# Altium schematic sheet Sheet_2_2021-06-04.schdoc
size 628 x 245 mm
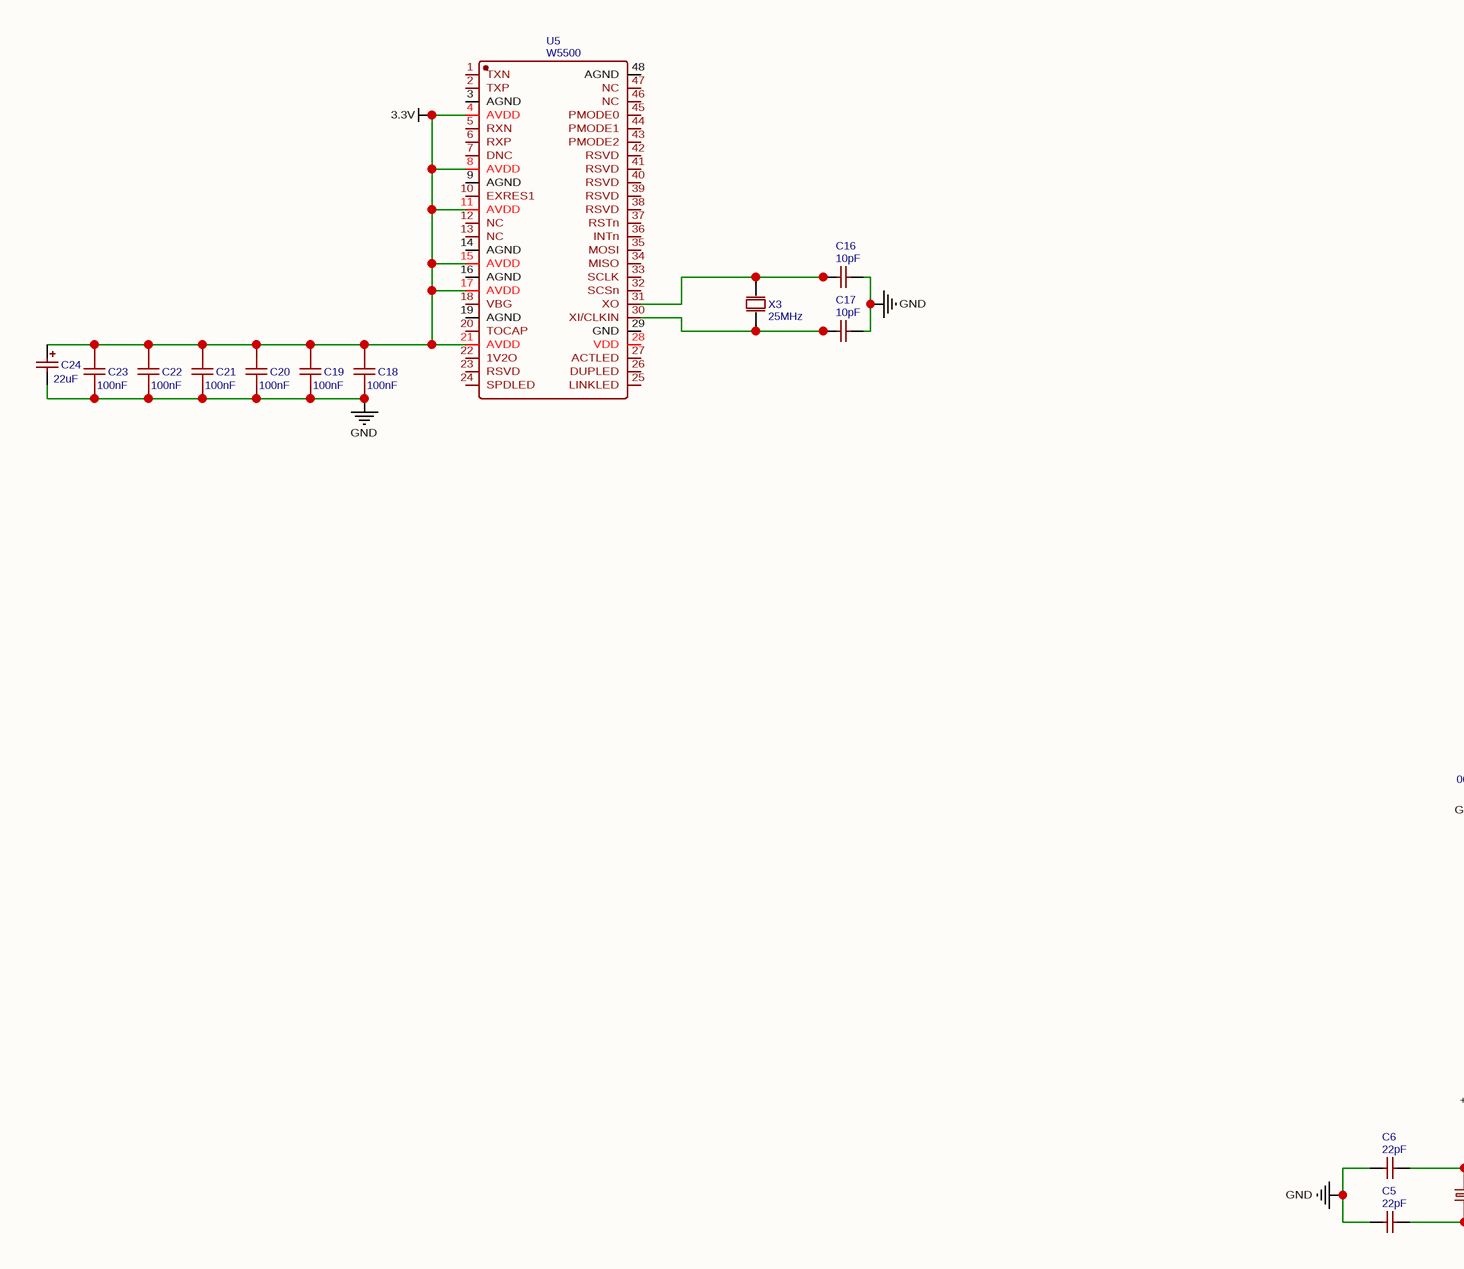
[diagram p0: Sheet_2_2021-06-04.schdoc, left]
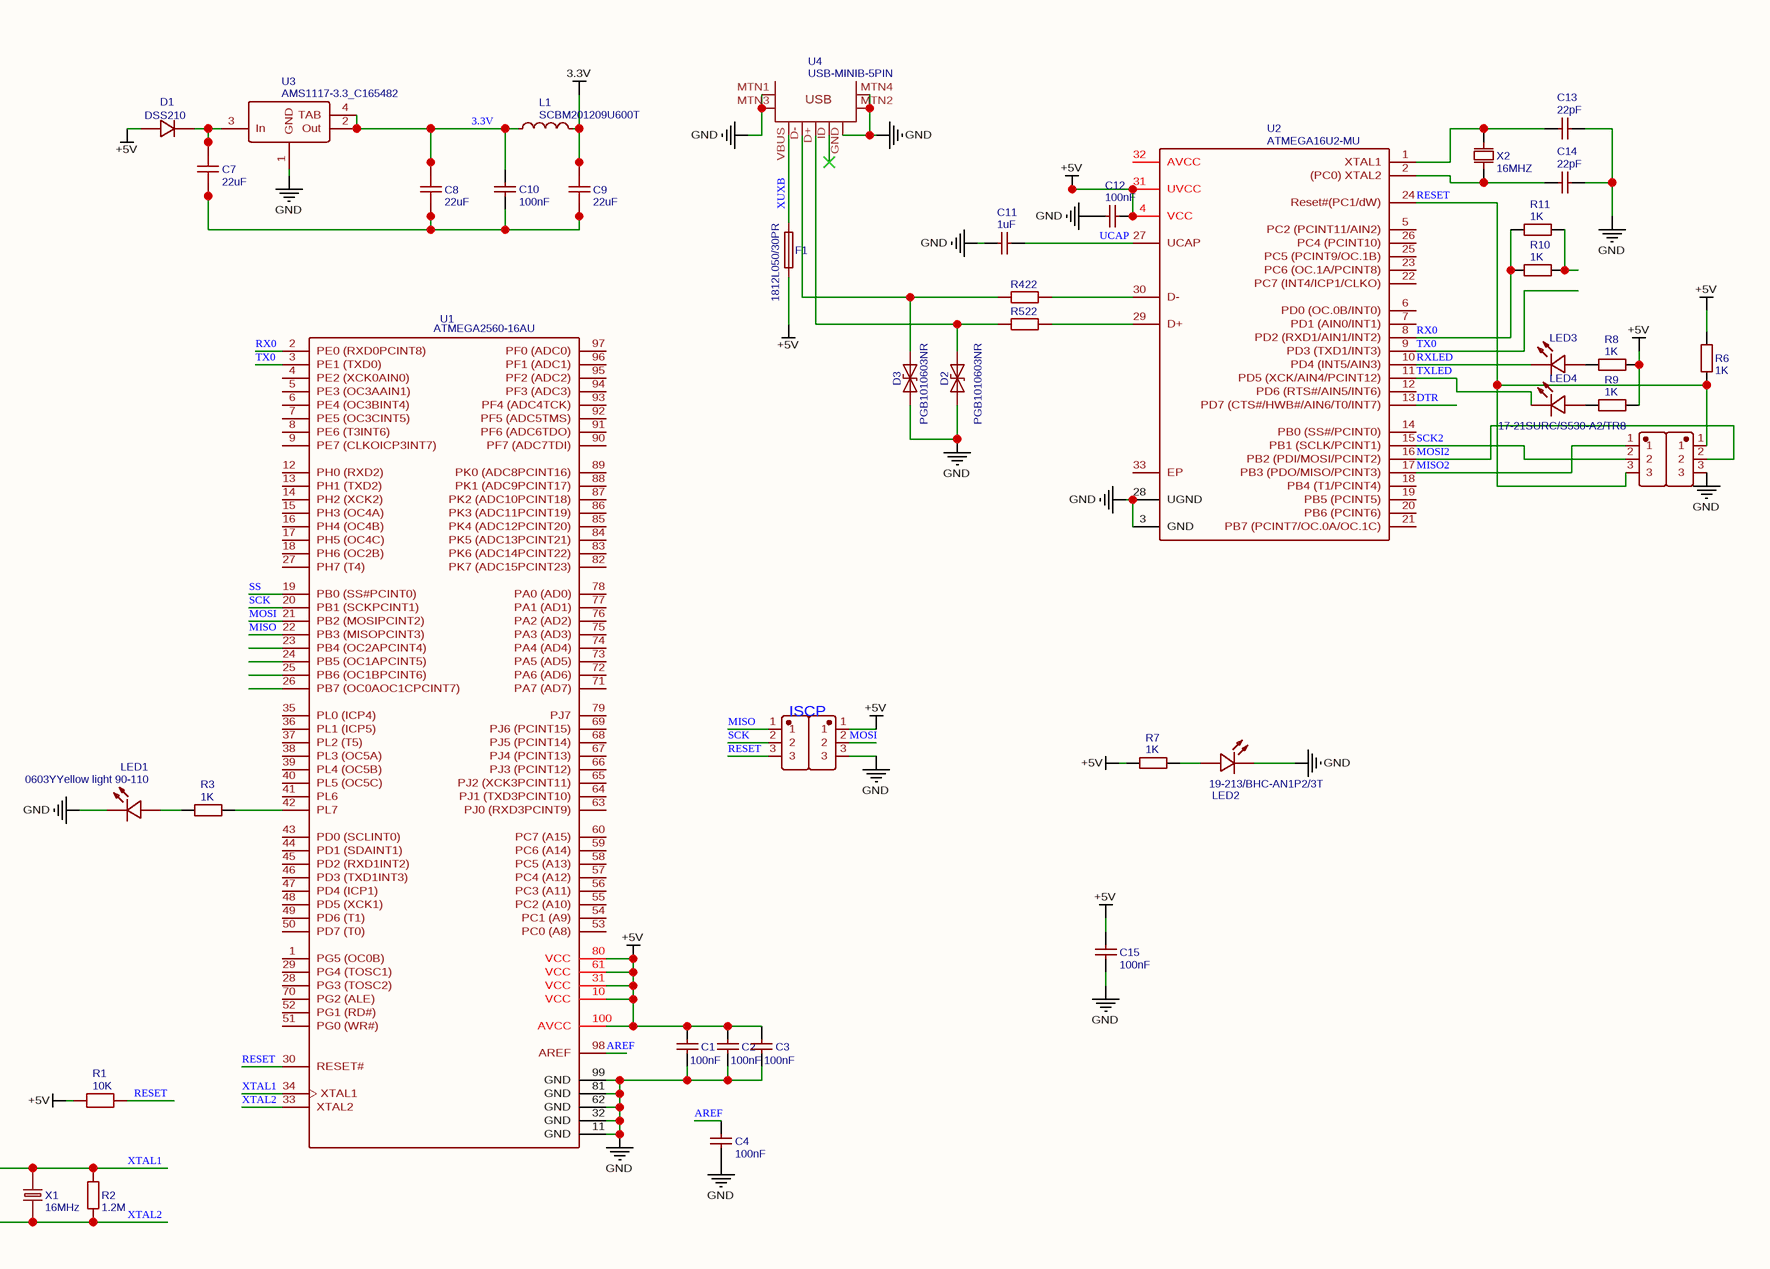
[diagram p1: Sheet_2_2021-06-04.schdoc, right]

## Parts
C1  100nF  [C0603]
C2  100nF  [C0603]
C3  100nF  [C0603]
C4  100nF  [C0603]
C5  22pF  [C0201]
C6  22pF  [C0201]
C7  22uF  [C1206]
C8  22uF  [C1206]
C9  22uF  [C1206]
C10  100nF  [C0402]
C11  1uF  [C0603]
C12  100nF  [C0805]
C13  22pF  [C0201]
C14  22pF  [C0201]
C15  100nF  [C0805]
C16  10pF  [C0603]
C17  10pF  [C0603]
C18  100nF  [C1206]
C19  100nF  [C1206]
C20  100nF  [C1206]
C21  100nF  [C1206]
C22  100nF  [C1206]
C23  100nF  [C1206]
C24  22uF  [CAP-SMD_L3.2-W1.6-R-RD]
D1  DSS210  [SOD-123_L2.8-W1.8-LS3.7-FD]
D2  PGB1010603NR  [D0603-BI]
D3  PGB1010603NR  [D0603-BI]
F1  1812L050/30PR  [F1812]
H1  Z-211-0311-0021-001  [HDR-TH_3P-P2.54-V]  (value not drawn)
H2  Z-211-0311-0021-001  [HDR-TH_3P-P2.54-V]  (value not drawn)
H3  Z-211-0311-0021-001  [HDR-TH_3P-P2.54-V]  (value not drawn)
H4  Z-211-0311-0021-001  [HDR-TH_3P-P2.54-V]  (value not drawn)
L1  SCBM201209U600T  [L0805]
LED1  0603YYellow light 90-110  [LED0603-R-RD]
LED2  19-213/BHC-AN1P2/3T  [LED0603-RD]
LED3  17-21SURC/S530-A2/TR8  [LED0805-RD]  (value not drawn)
LED4  17-21SURC/S530-A2/TR8  [LED0805-RD]
R1  10K  [R0402]
R2  1.2M  [R1206]
R3  1K  [R1206]
R4  22  [R0402]
R5  22  [R0402]
R6  1K  [R1206]
R7  1K  [R1206]
R8  1K  [R1206]
R9  1K  [R1206]
R10  1K  [R0805]
R11  1K  [R0805]
U1  ATMEGA2560-16AU  [TQFP-100_L14.0-W14.0-P0.50-LS16.0-BL]
U2  ATMEGA16U2-MU  [QFN-32_L5.0-W5.0-P0.50-BL-EP3.4]
U3  AMS1117-3.3_C165482  [SOT-223_L6.5-W3.5-P2.30-LS7.0-BR]
U4  USB-MINIB-5PIN  [USB-MINIB]
U5  W5500  [LQFP-48_L7.0-W7.0-P0.50-LS9.0-BL]
X1  16MHz  [HC-49S_L11.4-W4.8]
X2  16MHZ  [HC-49US_L11.0-W4.6-P4.88]
X3  25MHz  [HC-49S_L11.4-W4.8]

## Nets
3.3V: C8.2 C9.2 C10.2 C18.2 C19.2 C20.2 C21.2 C22.2 C23.2 C24.1 L1.1 L1.2 U3.2(Out) U3.4(TAB) U5.4(AVDD) U5.8(AVDD) U5.11(AVDD) U5.15(AVDD) U5.17(AVDD) U5.21(AVDD)
+5V: C1.2 C2.2 C3.2 C12.2 C15.2 D1.1(A) F1.1 H2.1 R1.1 R6.2 R7.1 R8.2 R9.2 U1.10(VCC) U1.31(VCC) U1.61(VCC) U1.80(VCC) U1.100(AVCC) U2.4(VCC) U2.31(UVCC)
GND: C1.1 C2.1 C3.1 C4.1 C5.1 C6.1 C11.1 C12.1 C13.2 C14.2 C15.1 C16.2 C17.2 C18.1 C19.1 C20.1 C21.1 C22.1 C23.1 C24.2 D2.1 D3.1 H2.3 H4.3 LED1.2(K) LED2.1(K) U1.11(GND) U1.32(GND) U1.62(GND) U1.81(GND) U1.99(GND) U2.3(GND) U2.28(UGND) U3.1(GND) U4.GND U4.MTN1(MTN2) U4.MTN2(MTN3) U4.MTN3(MTN1) U4.MTN4
AREF: C4.2 U1.98(AREF)
DTR: U2.13(PD7_(CTS#/HWB#/AIN6/T0/INT7))
MISO: H1.1 U1.22(PB3_(MISOPCINT3))
MISO2: H3.1 U2.17(PB3_(PDO/MISO/PCINT3))
MOSI: H2.2 U1.21(PB2_(MOSIPCINT2))
MOSI2: H4.2 U2.16(PB2_(PDI/MOSI/PCINT2))
RESET: H1.3 H3.3 H4.1 R1.2 R6.1 U1.30(RESET#) U2.24(Reset#(PC1/dW))
RX0: R10.1 R11.1 U1.2(PE0_(RXD0PCINT8)) U2.8(PD2_(RXD1/AIN1/INT2))
RXLED: LED3.1(K) U2.10(PD4_(INT5/AIN3))
SCK: H1.2 U1.20(PB1_(SCKPCINT1))
SCK2: H3.2 U2.15(PB1_(SCLK/PCINT1))
SS: U1.19(PB0_(SS#PCINT0))
TX0: U1.3(PE1_(TXD0)) U2.9(PD3_(TXD1/INT3))
TXLED: LED4.1(K) U2.11(PD5_(XCK/AIN4/PCINT12))
UCAP: C11.2 U2.27(UCAP)
XTAL1: C6.2 R2.2 U1.34(XTAL1) X1.2
XTAL2: C5.2 R2.1 U1.33(XTAL2) X1.1
XUXB: F1.2 U4.VBUS
NetC7_1: C7.1 C8.1 C9.1 C10.1
NetC7_2: C7.2 D1.2(K) U3.3(In)
NetC13_1: C13.1 U2.1(XTAL1) X2.2(OSC2)
NetC14_1: C14.1 U2.2((PC0)_XTAL2) X2.1(OSC1)
NetC16_1: C16.1 U5.31(XO) X3.2(OSC2)
NetC17_1: C17.1 U5.30(XI/CLKIN) X3.1(OSC1)
NetD2_2: D2.2 R5.1 U4.D+
NetD3_2: D3.2 R4.1 U4.D-
NetLED1_1: LED1.1(A) R3.1
NetLED2_2: LED2.2(A) R7.2
NetLED3_2: LED3.2(A) R8.1
NetLED4_2: LED4.2(A) R9.1
NetR3_2: R3.2 U1.42(PL7)
NetR4_2: R4.2 U2.30(D-)
NetR5_2: R5.2 U2.29(D+)
NetR10_2: R10.2 R11.2

Not connected (* = marked no-connect by the designer): U1 1(PG5_(OC0B)) 4(PE2_(XCK0AIN0)) 5(PE3_(OC3AAIN1)) 6(PE4_(OC3BINT4)) 7(PE5_(OC3CINT5)) 8(PE6_(T3INT6)) 9(PE7_(CLKOICP3INT7)) 12(PH0_(RXD2)) 13(PH1_(TXD2)) 14(PH2_(XCK2)) 15(PH3_(OC4A)) 16(PH4_(OC4B)) 17(PH5_(OC4C)) 18(PH6_(OC2B)) 23(PB4_(OC2APCINT4)) 24(PB5_(OC1APCINT5)) 25(PB6_(OC1BPCINT6)) 26(PB7_(OC0AOC1CPCINT7)) 27(PH7_(T4)) 28(PG3_(TOSC2)) 29(PG4_(TOSC1)) 35(PL0_(ICP4)) 36(PL1_(ICP5)) 37(PL2_(T5)) 38(PL3_(OC5A)) 39(PL4_(OC5B)) 40(PL5_(OC5C)) 41(PL6) 43(PD0_(SCLINT0)) 44(PD1_(SDAINT1)) 45(PD2_(RXD1INT2)) 46(PD3_(TXD1INT3)) 47(PD4_(ICP1)) 48(PD5_(XCK1)) 49(PD6_(T1)) 50(PD7_(T0)) 51(PG0_(WR#)) 52(PG1_(RD#)) 53(PC0_(A8)) 54(PC1_(A9)) 55(PC2_(A10)) 56(PC3_(A11)) 57(PC4_(A12)) 58(PC5_(A13)) 59(PC6_(A14)) 60(PC7_(A15)) 63(PJ0_(RXD3PCINT9)) 64(PJ1_(TXD3PCINT10)) 65(PJ2_(XCK3PCINT11)) 66(PJ3_(PCINT12)) 67(PJ4_(PCINT13)) 68(PJ5_(PCINT14)) 69(PJ6_(PCINT15)) 70(PG2_(ALE)) 71(PA7_(AD7)) 72(PA6_(AD6)) 73(PA5_(AD5)) 74(PA4_(AD4)) 75(PA3_(AD3)) 76(PA2_(AD2)) 77(PA1_(AD1)) 78(PA0_(AD0)) 79(PJ7) 82(PK7_(ADC15PCINT23)) 83(PK6_(ADC14PCINT22)) 84(PK5_(ADC13PCINT21)) 85(PK4_(ADC12PCINT20)) 86(PK3_(ADC11PCINT19)) 87(PK2_(ADC10PCINT18)) 88(PK1_(ADC9PCINT17)) 89(PK0_(ADC8PCINT16)) 90(PF7_(ADC7TDI)) 91(PF6_(ADC6TDO)) 92(PF5_(ADC5TMS)) 93(PF4_(ADC4TCK)) 94(PF3_(ADC3)) 95(PF2_(ADC2)) 96(PF1_(ADC1)) 97(PF0_(ADC0)); U2 5(PC2_(PCINT11/AIN2)) 6(PD0_(OC.0B/INT0)) 7(PD1_(AIN0/INT1)) 12(PD6_(RTS#/AIN5/INT6)) 14(PB0_(SS#/PCINT0)) 18(PB4_(T1/PCINT4)) 19(PB5_(PCINT5)) 20(PB6_(PCINT6)) 21(PB7_(PCINT7/OC.0A/OC.1C)) 22(PC7_(INT4/ICP1/CLKO)) 23(PC6_(OC.1A/PCINT8)) 25(PC5_(PCINT9/OC.1B)) 26(PC4_(PCINT10)) 32(AVCC) 33(EP); U4 ID*; U5 1(TXN) 2(TXP) 3(AGND) 5(RXN) 6(RXP) 7(DNC) 9(AGND) 10(EXRES1) 12(NC) 13(NC) 14(AGND) 16(AGND) 18(VBG) 19(AGND) 20(TOCAP) 22(1V2O) 23(RSVD) 24(SPDLED) 25(LINKLED) 26(DUPLED) 27(ACTLED) 28(VDD) 29(GND) 32(SCSn) 33(SCLK) 34(MISO) 35(MOSI) 36(INTn) 37(RSTn) 38(RSVD) 39(RSVD) 40(RSVD) 41(RSVD) 42(RSVD) 43(PMODE2) 44(PMODE1) 45(PMODE0) 46(NC) 47(NC) 48(AGND)

## Notes on the sheet
- ISCP
- (in symbol USB-MINIB-5PIN) USB

## Library data of the parts
C1-C4 = 100nF: BOM_Manufacturer Part: CL10B104JB8NNNC; BOM_Manufacturer: SAMSUNG; nameAlias: Capacitance; BOM_Supplier: LCSC; BOM_Supplier Part: C24452; BOM_JLCPCB Part Class: Extended Part; spicePre: C; spiceSymbolName: CL10B104JB8NNNC
C5 C6 C13 C14 = 22pF: BOM_Manufacturer: FH; BOM_Manufacturer Part: 0201CG220J500NT; nameAlias: Capacitance; BOM_Supplier: LCSC; BOM_Supplier Part: C57783; spicePre: C; spiceSymbolName: 0201CG220J500NT
C7-C9 = 22uF: BOM_Manufacturer: FH; BOM_Manufacturer Part: 1206B226K160NT; nameAlias: Capacitance; BOM_Supplier: LCSC; BOM_Supplier Part: C31847; spicePre: C; spiceSymbolName: 1206B226K160NT
C10 = 100nF: BOM_Manufacturer: FH; BOM_Manufacturer Part: 0402B104K160NT; nameAlias: Capacitance; BOM_Supplier: LCSC; BOM_Supplier Part: C41851; BOM_JLCPCB Part Class: Extended Part; spicePre: C; spiceSymbolName: 0402B104K160NT
C11 = 1uF: BOM_Manufacturer Part: CL10A105KB8NNNC; BOM_Manufacturer: SAMSUNG; nameAlias: Capacitance; BOM_Supplier: LCSC; BOM_Supplier Part: C15849; BOM_JLCPCB Part Class: Basic Part; spicePre: C; spiceSymbolName: CL10A105KB8NNNC
C12 = 100nF: BOM_Manufacturer Part: CL21F104ZBCNNNC; BOM_Manufacturer: SAMSUNG; nameAlias: Capacitance; BOM_Supplier: LCSC; BOM_Supplier Part: C1760; BOM_JLCPCB Part Class: Extended Part; spicePre: C; spiceSymbolName: CL21F104ZBCNNNC
C15 = 100nF: BOM_Manufacturer: FH; BOM_Manufacturer Part: 0805B104K500NT; nameAlias: Capacitance; BOM_Supplier: LCSC; BOM_Supplier Part: C38141; BOM_JLCPCB Part Class: Extended Part; spicePre: C; spiceSymbolName: 0805B104K500NT
C16 C17 = 10pF: BOM_Manufacturer: FH; BOM_Manufacturer Part: 0603CG100J201NT; nameAlias: Capacitance; BOM_Supplier: LCSC; BOM_Supplier Part: C63673; spicePre: C; spiceSymbolName: 0603CG100J201NT
C18-C23 = 100nF: BOM_Manufacturer: MuRata; BOM_Manufacturer Part: GRM319R71H104KA01D; nameAlias: Capacitance; BOM_Supplier: LCSC; BOM_Supplier Part: C86047; spicePre: C; spiceSymbolName: GRM319R71H104KA01D
C24 = 22uF: BOM_Manufacturer: CEC; BOM_Manufacturer Part: CA45A-A-10V-22UF-K; nameAlias: Capacitance; BOM_Supplier: LCSC; BOM_Supplier Part: C141745; BOM_JLCPCB Part Class: Extended Part; spicePre: C; spiceSymbolName: CA45A-A-10V-22UF-K
D1 = DSS210: BOM_Manufacturer: Bourne Semicon (Shenzhen); Contributor: LCSC; BOM_Paste Type: Extended Part; BOM_Supplier: LCSC; BOM_Supplier Part: C511868; BOM_Manufacturer Part: DSS210; BOM_JLCPCB Part Class: Extended Part; JLCPCB Part Class: Extended Part; spicePre: D; spiceSymbolName: DSS210
D2 D3 = PGB1010603NR: BOM_Manufacturer: Littelfuse; BOM_Supplier: LCSC; BOM_Manufacturer Part: PGB1010603NR; BOM_Supplier Part: C10677; BOM_JLCPCB Part Class: Extended Part; spicePre: D; spiceSymbolName: PGB1010603NR
F1 = 1812L050/30PR: BOM_Manufacturer: Littelfuse; Contributor: LCSC; BOM_Supplier: LCSC; BOM_Supplier Part: C151168; BOM_Manufacturer Part: 1812L050/30PR; BOM_JLCPCB Part Class: Extended Part; spicePre: F; spiceSymbolName: 1812L050/30PR
H1-H4 = Z-211-0311-0021-001: BOM_Manufacturer: ZHENGLING; Contributor: LCSC; BOM_Supplier: LCSC; BOM_Manufacturer Part: Z-211-0311-0021-001; BOM_Supplier Part: C152153; BOM_JLCPCB Part Class: Extended Part; spicePre: H; spiceSymbolName: Z-211-0311-0021-001
L1 = SCBM201209U600T: BOM_Manufacturer: Yanchuang; Contributor: LCSC; BOM_Supplier: LCSC; BOM_Supplier Part: C494710; BOM_Manufacturer Part: SCBM201209U600T; spicePre: L; spiceSymbolName: SCBM201209U600T
LED1 = 0603YYellow light 90-110: BOM_Manufacturer: KENTO; BOM_Manufacturer Part: 0603YYellow light 亮度90-110; BOM_Supplier: LCSC; BOM_Supplier Part: C2287; BOM_JLCPCB Part Class: Extended Part; spicePre: L; spiceSymbolName: 0603YYellow light 90-110
LED2 = 19-213/BHC-AN1P2/3T: BOM_Manufacturer: EVERLIGHT; Contributor: LCSC; BOM_Supplier: LCSC; BOM_Manufacturer Part: 19-213/BHC-AN1P2/3T; BOM_Supplier Part: C142304; BOM_JLCPCB Part Class: Extended Part; spicePre: L; spiceSymbolName: 19-213/BHC-AN1P2/3T
LED3 LED4 = 17-21SURC/S530-A2/TR8: BOM_Manufacturer: EVERLIGHT; Contributor: LCSC; BOM_Supplier: LCSC; BOM_Manufacturer Part: 17-21SURC/S530-A2/TR8; BOM_Supplier Part: C131244; BOM_JLCPCB Part Class: Extended Part; spicePre: L; spiceSymbolName: 17-21SURC/S530-A2/TR8
R1 = 10K: BOM_Manufacturer: YAGEO; BOM_Manufacturer Part: AC0402DR-0710KL; nameAlias: Resistance (Ohms); Contributor: LCSC; BOM_Supplier: LCSC; BOM_Supplier Part: C226679; BOM_JLCPCB Part Class: Extended Part; spicePre: R; spiceSymbolName: AC0402DR-0710KL
R2 = 1.2M: BOM_Manufacturer: Hokuriku Elec Industry; BOM_Manufacturer Part: HCR32-125FV; nameAlias: Resistance (Ohms); Contributor: LCSC; BOM_Supplier: LCSC; BOM_Supplier Part: C150391; BOM_JLCPCB Part Class: Extended Part; spicePre: R; spiceSymbolName: HCR32-125FV
R3 R6 = 1K: BOM_Manufacturer: UniOhm; BOM_Manufacturer Part: 1206W4F1001T5E; nameAlias: Resistance (Ohms); BOM_Supplier: LCSC; BOM_Supplier Part: C4410; BOM_JLCPCB Part Class: Basic Part; spicePre: R; spiceSymbolName: 1206W4F1001T5E
R4 R5 = 22: BOM_Manufacturer: YAGEO; BOM_Manufacturer Part: AC0402JR-0722RL; nameAlias: Resistance (Ohms); Contributor: LCSC; BOM_Supplier: LCSC; BOM_Supplier Part: C144722; BOM_JLCPCB Part Class: Extended Part; spicePre: R; spiceSymbolName: AC0402JR-0722RL
R7-R9 = 1K: BOM_Manufacturer: UniOhm; BOM_Manufacturer Part: 1206W4J0102T5E; nameAlias: Resistance (Ohms); BOM_Supplier: LCSC; BOM_Supplier Part: C1469; BOM_JLCPCB Part Class: Extended Part; spicePre: R; spiceSymbolName: 1206W4J0102T5E
R10 R11 = 1K: BOM_Manufacturer: FH; BOM_Manufacturer Part: RS-05K102JT; nameAlias: Resistance (Ohms); BOM_Supplier: LCSC; BOM_Supplier Part: C115302; BOM_JLCPCB Part Class: Extended Part; spicePre: R; spiceSymbolName: RS-05K102JT
U1 = ATMEGA2560-16AU: BOM_Manufacturer: MICROCHIP; BOM_Supplier: LCSC; BOM_Manufacturer Part: ATMEGA2560-16AU; BOM_Supplier Part: C22460; BOM_JLCPCB Part Class: Extended Part; spicePre: U; spiceSymbolName: ATMEGA2560-16AU
U2 = ATMEGA16U2-MU: BOM_Manufacturer: MICROCHIP; BOM_Supplier: LCSC; BOM_Manufacturer Part: ATMEGA16U2-MU; BOM_Supplier Part: C17317; BOM_JLCPCB Part Class: Extended Part; spicePre: U; spiceSymbolName: ATMEGA16U2-MU
U3 = AMS1117-3.3_C165482: BOM_Manufacturer: SK; Contributor: LCSC; BOM_Supplier: LCSC; BOM_Supplier Part: C165482; BOM_Manufacturer Part: AMS1117-3.3; BOM_JLCPCB Part Class: Extended Part; spicePre: U; spiceSymbolName: AMS1117-3.3_C165482
U4 = USB-MINIB-5PIN: description: Mini-USB B connector with 5th pin broken out.; Contributor: SparkFun; spicePre: U; spiceSymbolName: USB-MINIB-5PIN
U5 = W5500: BOM_Manufacturer: WIZNET; BOM_Supplier: LCSC; BOM_Manufacturer Part: W5500; BOM_Supplier Part: C32843; spicePre: U; spiceSymbolName: W5500
X1 = 16MHz: BOM_Manufacturer: TAE; BOM_Manufacturer Part: HC-49SM16MHz20pF30ppm; nameAlias: Frequency; BOM_Supplier: LCSC; BOM_Supplier Part: C111377; BOM_JLCPCB Part Class: Extended Part; spicePre: X; spiceSymbolName: HC-49SM16MHz20pF30ppm
X2 = 16MHZ: BOM_Manufacturer: JGHC; BOM_Manufacturer Part: 49SAC16000202060; nameAlias: Value; Contributor: LCSC; BOM_Supplier: LCSC; BOM_Supplier Part: C390745; BOM_JLCPCB Part Class: Extended Part; spicePre: X; spiceSymbolName: 49SAC16000202060
X3 = 25MHz: BOM_Manufacturer: YXC; BOM_Manufacturer Part: X49SM25MSD2SC; nameAlias: Frequency; BOM_Supplier: LCSC; BOM_Supplier Part: C14872; BOM_JLCPCB Part Class: Extended Part; spicePre: X; spiceSymbolName: X49SM25MSD2SC